# Altium schematic sheet ADCduinoModule_Sensor_2.SchDoc
size 594 x 420 mm; DocumentNumber: Введите номер платы + Э3; SheetNumber: номер страницы; Format: A2
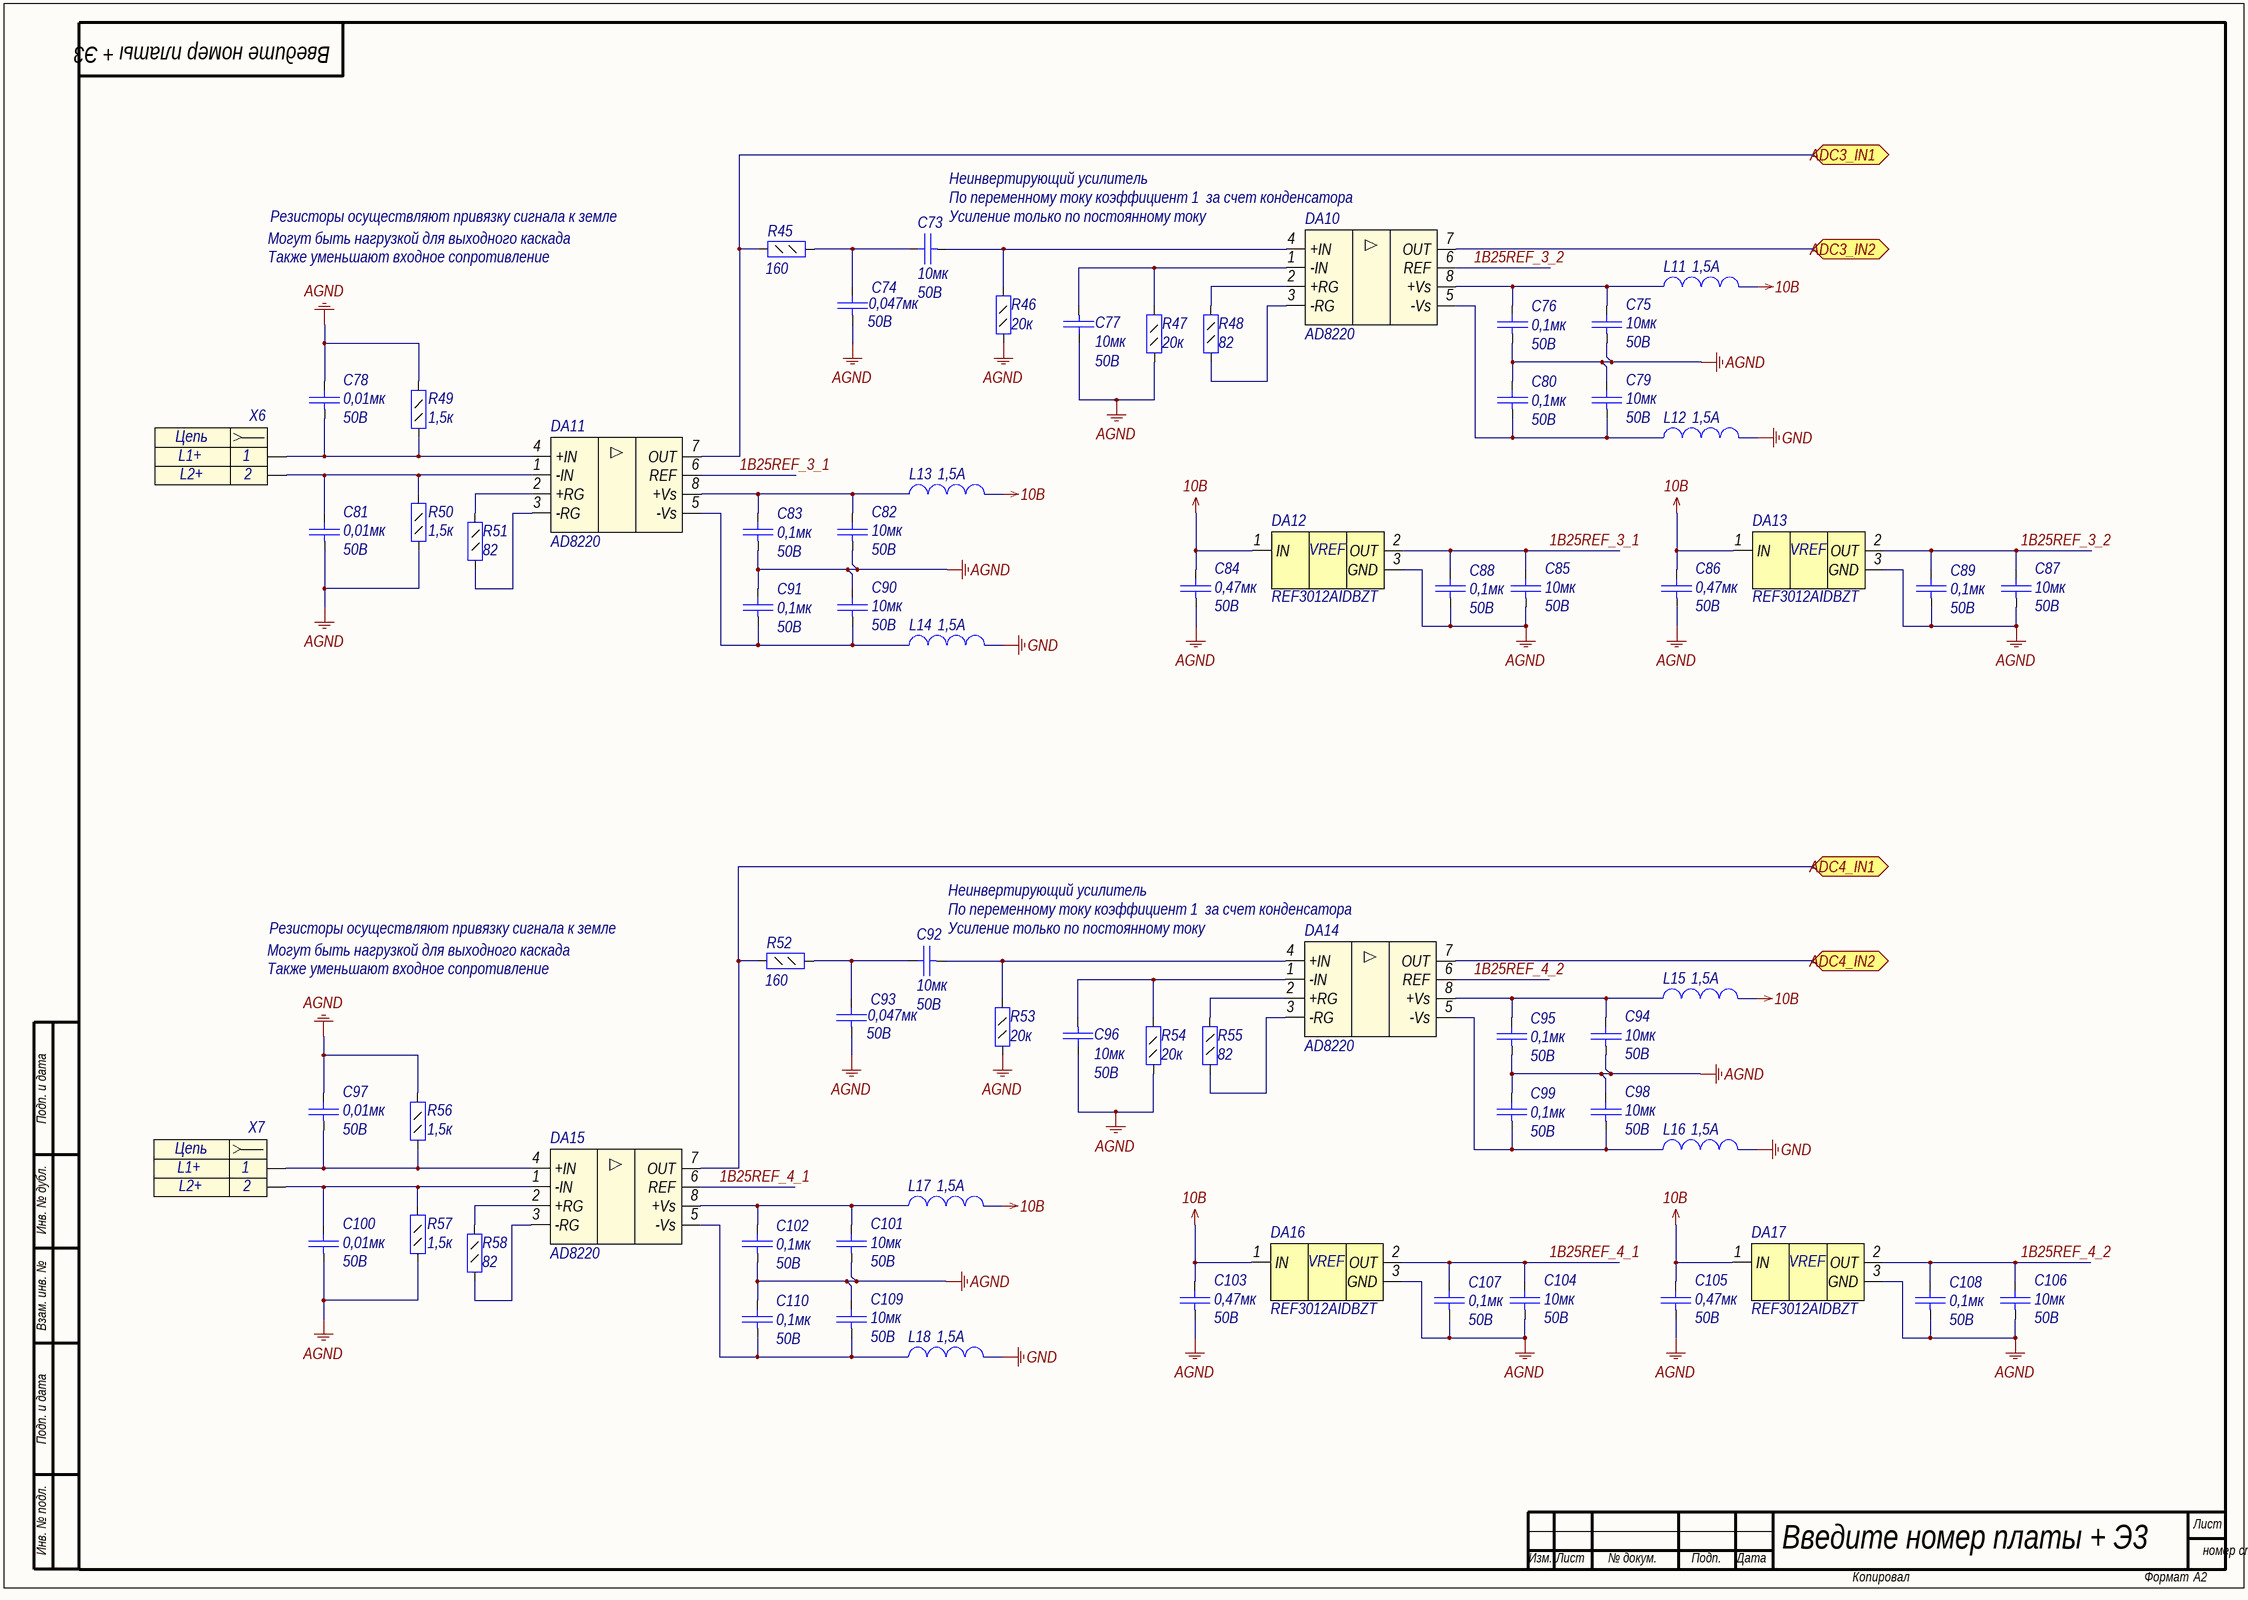
[diagram p0: ADCduinoModule_Sensor_2.SchDoc]

## Parts
C73  value 10мк  Voltage: 50В  [C1210]  (hidden comment: Capacitor)
C74  value 0,047мк  Voltage: 50B  [C0805]  (hidden comment: Capacitor)
C75  value 10мк  Voltage: 50В  [C1210]  (hidden comment: Capacitor)
C76  value 0,1мк  Voltage: 50B  [C0805]  (hidden comment: Capacitor)
C77  value 10мк  Voltage: 50В  [C1210]  (hidden comment: Capacitor)
C78  value 0,01мк  Voltage: 50B  [C0805]  (hidden comment: Capacitor)
C79  value 10мк  Voltage: 50В  [C1210]  (hidden comment: Capacitor)
C80  value 0,1мк  Voltage: 50B  [C0805]  (hidden comment: Capacitor)
C81  value 0,01мк  Voltage: 50B  [C0805]  (hidden comment: Capacitor)
C82  value 10мк  Voltage: 50В  [C1210]  (hidden comment: Capacitor)
C83  value 0,1мк  Voltage: 50B  [C0805]  (hidden comment: Capacitor)
C84  value 0,47мк  Voltage: 50B  [C0805]  (hidden comment: Capacitor)
C85  value 10мк  Voltage: 50В  [C1210]  (hidden comment: Capacitor)
C86  value 0,47мк  Voltage: 50B  [C0805]  (hidden comment: Capacitor)
C87  value 10мк  Voltage: 50В  [C1210]  (hidden comment: Capacitor)
C88  value 0,1мк  Voltage: 50B  [C0805]  (hidden comment: Capacitor)
C89  value 0,1мк  Voltage: 50B  [C0805]  (hidden comment: Capacitor)
C90  value 10мк  Voltage: 50В  [C1210]  (hidden comment: Capacitor)
C91  value 0,1мк  Voltage: 50B  [C0805]  (hidden comment: Capacitor)
C92  value 10мк  Voltage: 50В  [C1210]  (hidden comment: Capacitor)
C93  value 0,047мк  Voltage: 50B  [C0805]  (hidden comment: Capacitor)
C94  value 10мк  Voltage: 50В  [C1210]  (hidden comment: Capacitor)
C95  value 0,1мк  Voltage: 50B  [C0805]  (hidden comment: Capacitor)
C96  value 10мк  Voltage: 50В  [C1210]  (hidden comment: Capacitor)
C97  value 0,01мк  Voltage: 50B  [C0805]  (hidden comment: Capacitor)
C98  value 10мк  Voltage: 50В  [C1210]  (hidden comment: Capacitor)
C99  value 0,1мк  Voltage: 50B  [C0805]  (hidden comment: Capacitor)
C100  value 0,01мк  Voltage: 50B  [C0805]  (hidden comment: Capacitor)
C101  value 10мк  Voltage: 50В  [C1210]  (hidden comment: Capacitor)
C102  value 0,1мк  Voltage: 50B  [C0805]  (hidden comment: Capacitor)
C103  value 0,47мк  Voltage: 50B  [C0805]  (hidden comment: Capacitor)
C104  value 10мк  Voltage: 50В  [C1210]  (hidden comment: Capacitor)
C105  value 0,47мк  Voltage: 50B  [C0805]  (hidden comment: Capacitor)
C106  value 10мк  Voltage: 50В  [C1210]  (hidden comment: Capacitor)
C107  value 0,1мк  Voltage: 50B  [C0805]  (hidden comment: Capacitor)
C108  value 0,1мк  Voltage: 50B  [C0805]  (hidden comment: Capacitor)
C109  value 10мк  Voltage: 50В  [C1210]  (hidden comment: Capacitor)
C110  value 0,1мк  Voltage: 50B  [C0805]  (hidden comment: Capacitor)
DA10  AD8220  [MSOP8]
DA11  AD8220  [MSOP8]
DA12  Part Number: REF3012AIDBZT  [SOT23-3]  (hidden comment: REF30xx)
DA13  Part Number: REF3012AIDBZT  [SOT23-3]  (hidden comment: REF30xx)
DA14  AD8220  [MSOP8]
DA15  AD8220  [MSOP8]
DA16  Part Number: REF3012AIDBZT  [SOT23-3]  (hidden comment: REF30xx)
DA17  Part Number: REF3012AIDBZT  [SOT23-3]  (hidden comment: REF30xx)
L11  Rated Current: 1,5A  [L0603]  (hidden comment: Inductor)
L12  Rated Current: 1,5A  [L0603]  (hidden comment: Inductor)
L13  Rated Current: 1,5A  [L0603]  (hidden comment: Inductor)
L14  Rated Current: 1,5A  [L0603]  (hidden comment: Inductor)
L15  Rated Current: 1,5A  [L0603]  (hidden comment: Inductor)
L16  Rated Current: 1,5A  [L0603]  (hidden comment: Inductor)
L17  Rated Current: 1,5A  [L0603]  (hidden comment: Inductor)
L18  Rated Current: 1,5A  [L0603]  (hidden comment: Inductor)
R45  value 160  [R0805]  (hidden comment: Resistor_0,125Вт)
R46  value 20к  [R0805]  (hidden comment: Resistor_0,125Вт)
R47  value 20к  [R0805]  (hidden comment: Resistor_0,125Вт)
R48  value 82  [R0805]  (hidden comment: Resistor_0,125Вт)
R49  value 1,5к  [R0805]  (hidden comment: Resistor_0,125Вт)
R50  value 1,5к  [R0805]  (hidden comment: Resistor_0,125Вт)
R51  value 82  [R0805]  (hidden comment: Resistor_0,125Вт)
R52  value 160  [R0805]  (hidden comment: Resistor_0,125Вт)
R53  value 20к  [R0805]  (hidden comment: Resistor_0,125Вт)
R54  value 20к  [R0805]  (hidden comment: Resistor_0,125Вт)
R55  value 82  [R0805]  (hidden comment: Resistor_0,125Вт)
R56  value 1,5к  [R0805]  (hidden comment: Resistor_0,125Вт)
R57  value 1,5к  [R0805]  (hidden comment: Resistor_0,125Вт)
R58  value 82  [R0805]  (hidden comment: Resistor_0,125Вт)
X6  Header_2_sct  [TAB_2PAD]  (value not drawn)
X7  Header_2_sct  [TAB_2PAD]  (value not drawn)

## Ports
ADC3_IN1, ADC3_IN2, ADC4_IN1, ADC4_IN2

## Nets
10B: C84.2 C86.2 C103.2 C105.2 DA12.1(IN) DA13.1(IN) DA16.1(IN) DA17.1(IN) L11.2 L13.2 L15.2 L17.2
AGND: C74.1 C75.1 C76.1 C77.2 C78.2 C79.2 C80.2 C81.1 C82.1 C83.1 C84.1 C85.1 C86.1 C87.1 C88.1 C89.1 C90.2 C91.2 C93.1 C94.1 C95.1 C96.2 C97.2 C98.2 C99.2 C100.1 C101.1 C102.1 C103.1 C104.1 C105.1 C106.1 C107.1 C108.1 C109.2 C110.2 DA12.3(GND) DA13.3(GND) DA16.3(GND) DA17.3(GND) R46.1 R47.1 R49.2 R50.1 R53.1 R54.1 R56.2 R57.1
GND: L12.2 L14.2 L16.2 L18.2
1B25REF_3_1: C85.2 C88.2 DA11.6(REF) DA12.2(OUT)
1B25REF_3_2: C87.2 C89.2 DA10.6(REF) DA13.2(OUT)
1B25REF_4_1: C104.2 C107.2 DA15.6(REF) DA16.2(OUT)
1B25REF_4_2: C106.2 C108.2 DA14.6(REF) DA17.2(OUT)
ADC3_IN1: DA11.7(OUT) R45.1 ; port ADC3_IN1
ADC3_IN2: DA10.7(OUT) ; port ADC3_IN2
ADC4_IN1: DA15.7(OUT) R52.1 ; port ADC4_IN1
ADC4_IN2: DA14.7(OUT) ; port ADC4_IN2
NetC73_1: C73.1 DA10.4(+IN) R46.2
NetC73_2: C73.2 C74.2 R45.2
NetC75_2: C75.2 C76.2 DA10.8(+Vs) L11.1
NetC77_1: C77.1 DA10.1(-IN) R47.2
NetC78_1: C78.1 DA11.4(+IN) R49.1 X6.1
NetC79_1: C79.1 C80.1 DA10.5(-Vs) L12.1
NetC81_2: C81.2 DA11.1(-IN) R50.2 X6.2
NetC82_2: C82.2 C83.2 DA11.8(+Vs) L13.1
NetC90_1: C90.1 C91.1 DA11.5(-Vs) L14.1
NetC92_1: C92.1 DA14.4(+IN) R53.2
NetC92_2: C92.2 C93.2 R52.2
NetC94_2: C94.2 C95.2 DA14.8(+Vs) L15.1
NetC96_1: C96.1 DA14.1(-IN) R54.2
NetC97_1: C97.1 DA15.4(+IN) R56.1 X7.1
NetC98_1: C98.1 C99.1 DA14.5(-Vs) L16.1
NetC100_2: C100.2 DA15.1(-IN) R57.2 X7.2
NetC101_2: C101.2 C102.2 DA15.8(+Vs) L17.1
NetC109_1: C109.1 C110.1 DA15.5(-Vs) L18.1
NetDA10_2: DA10.2(+RG) R48.1
NetDA10_3: DA10.3(-RG) R48.2
NetDA11_2: DA11.2(+RG) R51.1
NetDA11_3: DA11.3(-RG) R51.2
NetDA14_2: DA14.2(+RG) R55.1
NetDA14_3: DA14.3(-RG) R55.2
NetDA15_2: DA15.2(+RG) R58.1
NetDA15_3: DA15.3(-RG) R58.2

## Notes on the sheet
- Неинвертирующий усилитель
- По переменному току коэффициент 1  за счет конденсатора
- Могут быть нагрузкой для выходного каскада
- Также уменьшают входное сопротивление
- Резисторы осуществляют привязку сигнала к земле
- (near C73) Усиление только по постоянному току
- (near C92) Усиление только по постоянному току
- Подп. и дата
- Инв. № дубл.
- Взам. инв. №
- Инв. № подл.
- Лист
- Изм.
- № докум.
- Подп.
- Дата
- Копировал
- Формат
- (in symbol connect57) Цепь
- (in symbol REF3012AIDBZT) VREF

## Library data of the parts
C73 C75 C77 C79 C82 C85 C87 C90 C92 C94 C96 C98 C101 C104 C106 C109 = cap205: Конденсатор; Part Name: Ceramic; Manufacture: Murata; Part Number: GRM32ER71H106K; id: cap205; TKE: X7R
C74 C93 = cap140: Конденсатор; Part Name: Ceramic; Manufacture: Murata; Part Number: GRM21BR71H473K; id: cap140; TKE: X7R
C76 C80 C83 C88 C89 C91 C95 C99 C102 C107 C108 C110 = cap141: Конденсатор; Part Name: Ceramic; Manufacture: Murata; Part Number: GRM21BR71H104K**; id: cap141; TKE: X7R
C78 C81 C97 C100 = cap136: Конденсатор; Part Name: Ceramic; Manufacture: Murata; Part Number: GRM216R71H103K; id: cap136; TKE: X7R
C84 C86 C103 C105 = cap148: Конденсатор; Part Name: Ceramic; Manufacture: Murata; Part Number: GRM219R71C474K; id: cap148; TKE: X7R
DA10 DA11 DA14 DA15 = amp15: JFET Input Instrumentation Amplifier; Part Number: AD8220ARMZ; Manufacture: Analog Devices; id: amp15; Rail-to-rail: yes; Supply Voltage: 4,5В–36В or (+-)2,25В-(+-)18B; Supply Current max: 750uA; Bandwidth: 1,5MHz; Input Bias Current: 25pA; CMRR: 95dB; PSRR: 100dB; Offset voltage: (+-)0,125uB; Channels: 1; Part Name: JFET Input Instrumentation Amplifier
DA12 DA13 DA16 DA17 = REF3012AIDBZT: CMOS Voltage Reference; Manufacturer: Texas Instruments; id: ref2; Voltage min stabilize: 1,25B; Max input voltage: 5,5B; Accuracy: 0,002; Output current: 25mA; Part Name: CMOS Voltage Reference
L11-L18 = ind0: EMI Suppression Filter; Part Name: EMI Suppression Filters; Part Number: BLM18PG181SN1D; id: ind0; Resistance: 0,09Ohm
R45 R52 = res54: Резистор; Manufacture: Yageo; Part Number: RC0805FR-07160RL; id: res54; Accuracy: 0,01; Part Name: Resistor; Power: 0,125Вт
R46 R47 R53 R54 = res104: Резистор; Manufacture: Yageo; Part Number: RC0805FR-0720KL; id: res104; Accuracy: 0,01; Part Name: Resistor; Power: 0,125Вт
R48 R51 R55 R58 = res47: Резистор; Manufacture: Yageo; Part Number: RC0805FR-0782RL; id: res47; Accuracy: 0,01; Part Name: Resistor; Power: 0,125Вт
R49 R50 R56 R57 = res77: Резистор; Manufacture: Yageo; Part Number: RC0805FR-071K5; id: res77; Accuracy: 0,01; Part Name: Resistor; Power: 0,125Вт
X6 X7 = connect57: Разъем - 2 конт. розетка; Part Name: Place for wires; Contact_1: L1+; Contact_2: L2+; id: connect57